# EAGLE schematic power (EAGLE 9.6.1)
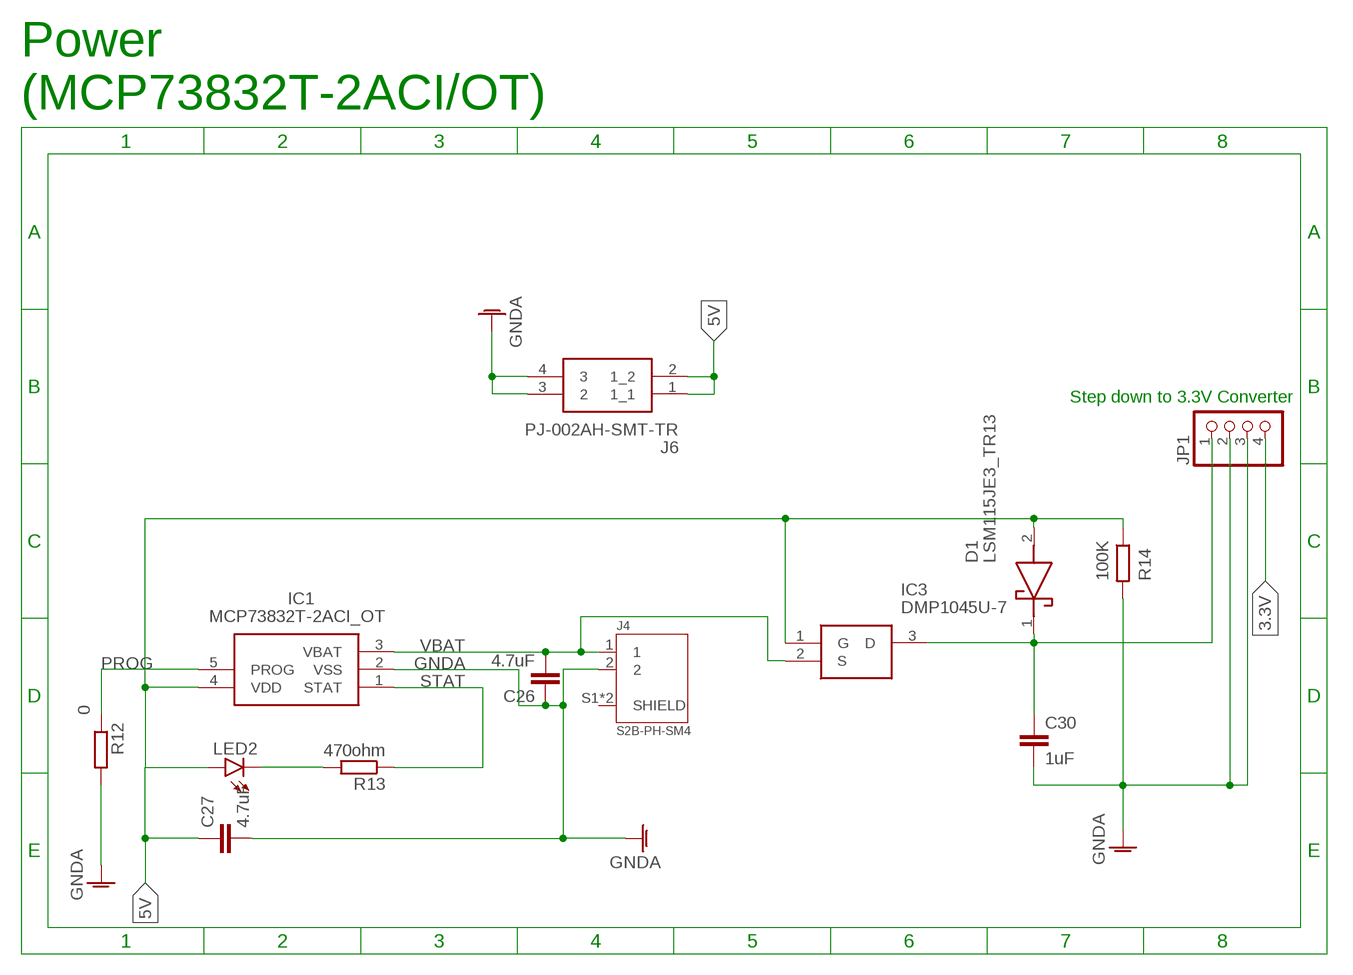
[diagram p0: schematic, sheet 1]

## Parts
C26  4.7uF  C-EU_1206C1206  [C1206]
C27  4.7uF  C-EU_1206C1206  [C1206]
C30  1uF  C-EU_805C0805  [C0805]
D1  LSM115JE3_TR13  [DIOM5436X330N]
IC1  MCP73832T-2ACI_OT  [SOT95P270X145-5N]
IC3  DMP1045U-7  [SOT96P240X100-3N]
J4  S2B-PH-SM4  [JST_S2B-PH-SM4-TB(LF)(SN)]
J6  PJ-002AH-SMT-TR  [PJ-002AH-SMT-TR]
JP1  PINHD-1X4  [1X04]
LED2  LED_1206SMT1206  [1206]
R12  0  R-EU_1206R1206  [R1206]
R13  470ohm  R-EU_1206R1206  [R1206]
R14  100K  R-EU_1206R1206  [R1206]

## Nets
3.3V: JP1.4
5V: C27.1 D1.2(A) IC1.4(VDD) IC3.1(G) J6.1(1_1) J6.2(1_2) LED2.A R14.1
GNDA: C26.1 C27.2 C30.2 IC1.2(VSS) J4.2 J6.3 J6.4 JP1.2 JP1.3 R12.2 R14.2
N$10: LED2.C R13.2
PROG: IC1.5(PROG) R12.1
STAT: IC1.1(STAT) R13.1
U_DRAIN: C30.1 D1.1(K) IC3.3(D) JP1.1
VBAT: C26.2 IC1.3(VBAT) IC3.2(S) J4.1
Unconnected: J4.S1(SHIELD) J4.S2(SHIELD)

## Notes on the sheet
- Power
  (MCP73832T-2ACI/OT)
- Step down to 3.3V Converter

## Library data of the parts
C26 C27 = CommonParts:C-EU_1206: CAPACITOR, European symbol; SPICEPREFIX: C
C30 = CommonParts:C-EU_805: CAPACITOR, European symbol; SPICEPREFIX: C
D1 = CommonParts:LSM115JE3_TR13: Schottky Diodes & Rectifiers Schottky Source: Datasheet <https://componentsearchengine.com/Datasheets/1/LSM115JE3_TR13.pdf>; DESCRIPTION: Schottky Diodes & Rectifiers Schottky; HEIGHT: 3.3mm; MANUFACTURER_NAME: Microsemi Corporation; MANUFACTURER_PART_NUMBER: LSM115JE3/TR13; MOUSER_PART_NUMBER: 494-LSM115JE3/TR13; MOUSER_PRICE-STOCK: https://www.mouser.com/Search/Refine.aspx?Keyword=494-LSM115JE3%2FTR13
IC1 = MouserUseful:MCP73832T-2ACI_OT: Battery Charger Lithium-Ion, Lithium-Polymer Source: Datasheet <https://componentsearchengine.com/Datasheets/1/MCP73832T-2ACI_OT.pdf>; DESCRIPTION: Battery Charger Lithium-Ion, Lithium-Polymer; HEIGHT: 1.45mm; MANUFACTURER_NAME: Microchip; MANUFACTURER_PART_NUMBER: MCP73832T-2ACI/OT; MOUSER_PART_NUMBER: 579-MCP73832T-2ACIOT; MOUSER_PRICE-STOCK: https://www.mouser.com/Search/Refine.aspx?Keyword=579-MCP73832T-2ACIOT
IC3 = MouserUseful:DMP1045U-7: P-Channel Enhancement MOSFET SOT-23 Diodes Inc DMP1045U-7 P-channel MOSFET Transistor, 5.2 A, -12 V, 3-Pin SOT23 Source: Datasheet <https://componentsearchengine.com/Datasheets/1/DMP1045U-7.pdf>; DESCRIPTION: P-Channel Enhancement MOSFET SOT-23 Diodes Inc DMP1045U-7 P-channel MOSFET Transistor, 5.2 A, -12 V, 3-Pin SOT23; HEIGHT: 1mm; MANUFACTURER_NAME: Diodes Inc.; MANUFACTURER_PART_NUMBER: DMP1045U-7; MOUSER_PART_NUMBER: 621-DMP1045U-7; MOUSER_PRICE-STOCK: https://www.mouser.com/Search/Refine.aspx?Keyword=621-DMP1045U-7
J4 = CommonParts:S2B-PH-SM4: PH Series 2 Position 2 mm Pitch Surface Mount Side Entry Shrouded Header; DESCRIPTION: PH Series 2 Position 2 mm Pitch Surface Mount Side Entry Shrouded Header; DIGI-KEY_PART_NUMBER: 455-1749-1-ND; DIGI-KEY_PURCHASE_URL: https://www.digikey.com/product-detail/en/jst-sales-america-inc/S2B-PH-SM4-TB_LF__SN_/455-1749-1-ND/926846?utm_source=snapeda&utm_medium=aggregator&utm_campaign=symbol; MF: JST Sales; MP: S2B-PH-SM4-TB_LF__SN_; PACKAGE: None
J6 = CommonParts:PJ-002AH-SMT-TR: DC Power Connectors Power Jacks Source: Datasheet <https://componentsearchengine.com/Datasheets/1/PJ-002AH-SMT-TR.pdf>; DESCRIPTION: DC Power Connectors Power Jacks; HEIGHT: mm; MANUFACTURER_NAME: CUI; MANUFACTURER_PART_NUMBER: PJ-002AH-SMT-TR; MOUSER_PART_NUMBER: 490-PJ-002AH-SMT-TR; MOUSER_PRICE-STOCK: https://www.mouser.com/Search/Refine.aspx?Keyword=490-PJ-002AH-SMT-TR
JP1 = pinhead:PINHD-1X4: PIN HEADER
LED2 = CommonParts:LED_1206: LED OSRAM: - CHIPLED LG R971, LG N971, LY N971, LG Q971, LY Q971, LO R971, LY R971 LH N974, LH R974 LS Q976, LO Q976, LY Q976 LO Q996 - Hyper CHIPLED LW Q18S LB Q993, LB Q99A, LB R99A - SideLED LS A670, LO A670, LY A670, LG A670, LP A670 LB A673, LV A673, LT A673, LW A673 LH A674 LY A675 LS A676, LA A676, LO A676, LY A676, LW A676 LS A679, LY A679, LG A679 - Hyper Micro SIDELED® LS Y876, LA Y876, LO Y876, LY Y876 LT Y87S - SmartLED LW L88C, LW L88S LB L89C, LB L89S, LG L890 LS L89K, LO L89K, LY L89K LS L896, LA L896, LO L896, LY L896 - TOPLED LS T670, LO T670, LY T670, LG T670, LP T670 LSG T670, LSP T670, LSY T670, LOP T670, LYG T670 LG T671, LOG T671, LSG T671 LB T673, LV T673, LT T673, LW T673 LH T674 LS T676, LA T676, LO T676, LY T676, LB T676, LH T676, LSB T676, LW T676 LB T67C, LV T67C, LT T67C, LS T67K, LO T67K, LY T67K, LW E67C LS E67B, LA E67B, LO E67B, LY E67B, LB E67C, LV E67C, LT E67C LW T67C LS T679, LY T679, LG T679 LS T770, LO T770, LY T770, LG T770, LP T770 LB T773, LV T773, LT T773, LW T773 LH T774 LS E675, LA E675, LY E675, LS T675 LS T776, LA T776, LO T776, LY T776, LB T776 LHGB T686 LT T68C, LB T68C - Hyper Mini TOPLED® LB M676 - Mini TOPLED Santana® LG M470 LS M47K, LO M47K, LY M47K Source: http://www.osram.convergy.de LUXEON: - LUMILED® LXK2-PW12-R00, LXK2-PW12-S00, LXK2-PW14-U00, LXK2-PW14-V00 LXK2-PM12-R00, LXK2-PM12-S00, LXK2-PM14-U00 LXK2-PE12-Q00, LXK2-PE12-R00, LXK2-PE12-S00, LXK2-PE14-T00, LXK2-PE14-U00 LXK2-PB12-K00, LXK2-PB12-L00, LXK2-PB12-M00, LXK2-PB14-N00, LXK2-PB14-P00, LXK2-PB14-Q00 LXK2-PR12-L00, LXK2-PR12-M00, LXK2-PR14-Q00, LXK2-PR14-R00 LXK2-PD12-Q00, LXK2-PD12-R00, LXK2-PD12-S00 LXK2-PH12-R00, LXK2-PH12-S00 LXK2-PL12-P00, LXK2-PL12-Q00, LXK2-PL12-R00 Source: www.luxeon.com KINGBRIGHT: KA-3528ASYC Source: www.kingbright.com
R12-R14 = CommonParts:R-EU_1206: RESISTOR, European symbol

## Net classes
0 default: width 0.7 mm, drill 0.8 mm, clearance 0.2 mm